# EAGLE design untitled (EAGLE 5.11)

## Sheet 1 of 3
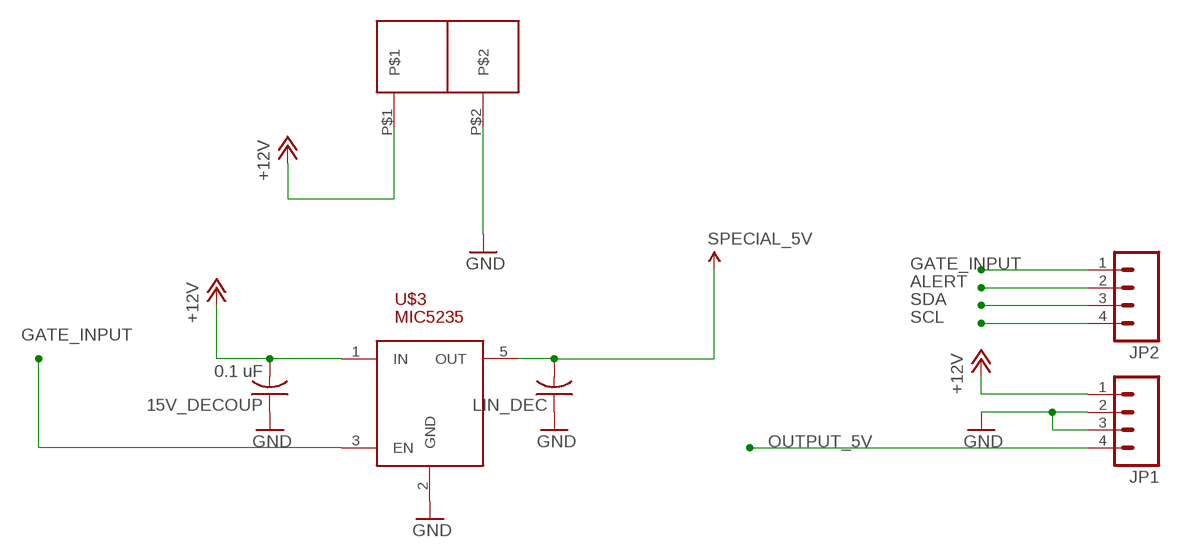
[diagram p0: schematic, sheet 1]

### Parts
15V_DECOUP  0.1 uF  C-USC0603K  [C0603K]
JP1  M04PTH  [1X04]
JP2  M04PTH  [1X04]
LIN_DEC  C-USC0603K  [C0603K]
U$1  PLUG_TERM_2  [TERM_BLOCK_2]
U$3  MIC5235  [SOT23-5]

### Nets
+12V: 15V_DECOUP.2 JP1.1 U$1.P$1 U$3.1(IN) ; also sheet 2
ALERT: JP2.2 ; also sheet 3
GATE_INPUT: JP2.1 U$3.3(EN) ; also sheet 2
GND: 15V_DECOUP.1 JP1.2 JP1.3 LIN_DEC.1 U$1.P$2 U$3.2(GND) ; also sheet 2,3
OUTPUT_5V: JP1.4 ; also sheet 3
SCL: JP2.4 ; also sheet 3
SDA: JP2.3 ; also sheet 3
VCC: LIN_DEC.2 U$3.5(OUT) ; supply symbol labelled SPECIAL_5V ; also sheet 3

## Sheet 2 of 3
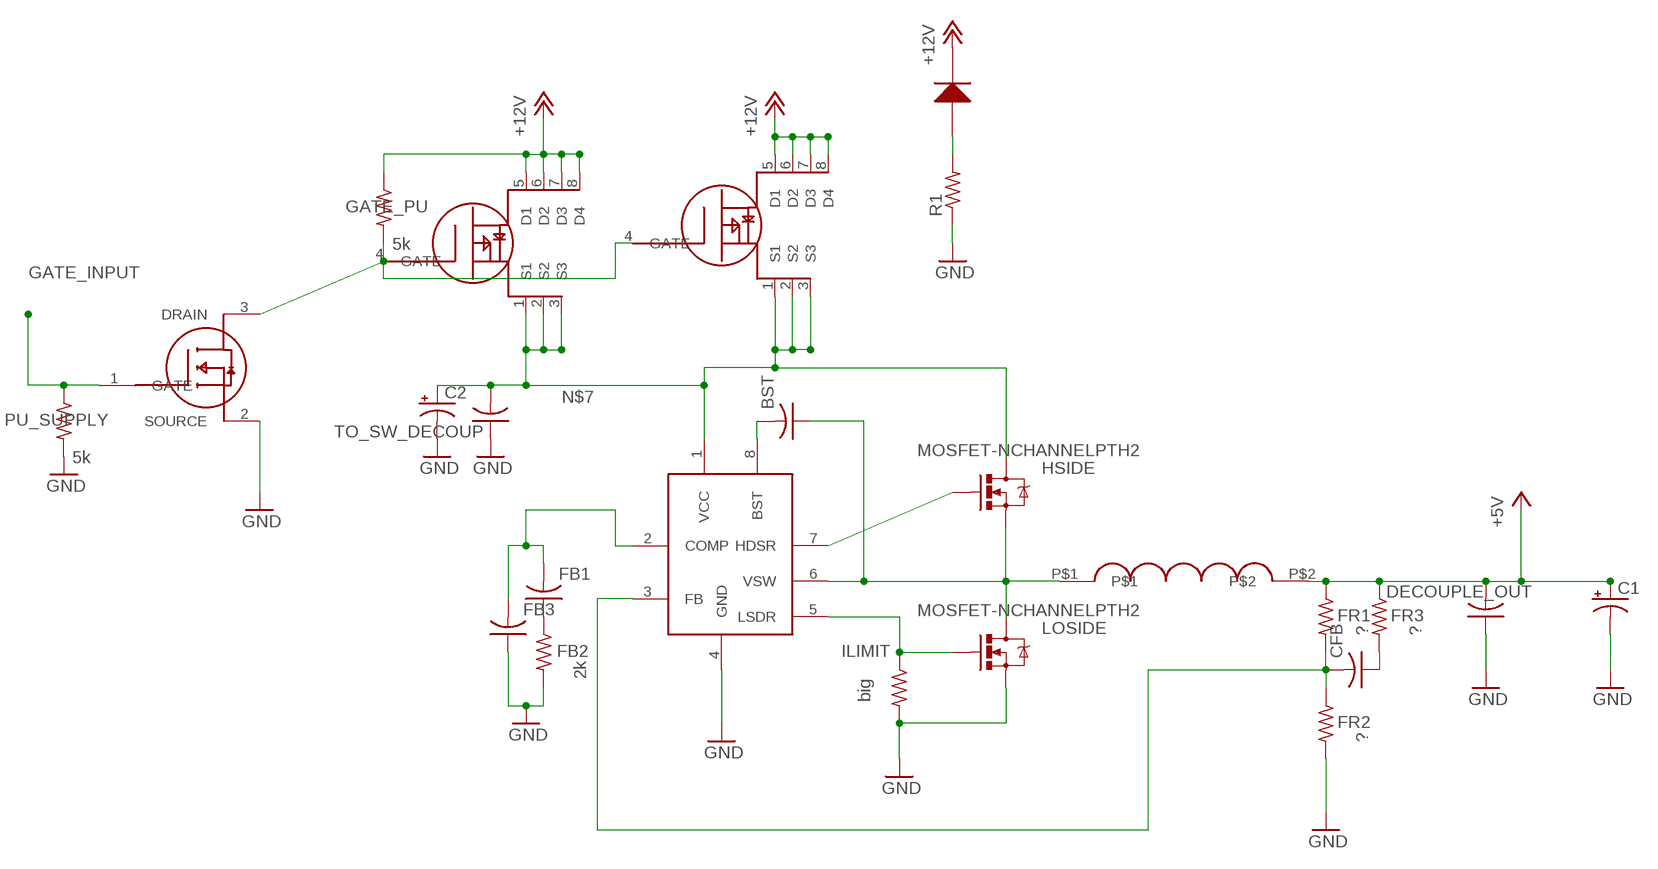
[diagram p1: schematic, sheet 2]

### Parts
BST  C-USC0603K  [C0603K]
C1  CAP_POLPTH2  [CPOL-RADIAL-10UF-25V]
C2  CAP_POLPTH2  [CPOL-RADIAL-10UF-25V]
CFB  C-USC0603K  [C0603K]
DECOUPLE_OUT  C-USC0603K  [C0603K]
FB1  C-USC0603K  [C0603K]
FB2  2k  R-US_R0805  [R0805]
FB3  C-USC0603K  [C0603K]
FR1  ?  R-US_R0805  [R0805]
FR2  ?  R-US_R0805  [R0805]
FR3  ?  R-US_R0805  [R0805]
GATE_PU  5k  R-US_R0805  [R0805]
HSIDE  MOSFET-NCHANNELPTH2  [TO220V]
ILIMIT  big  R-US_R0805  [R0805]
LOSIDE  MOSFET-NCHANNELPTH2  [TO220V]
PU_SUPPLY  5k  R-US_R0805  [R0805]
R1  R-US_R0805  [R0805]
SW_IN  LED  [D0805]
TO_SW_DECOUP  C-USC0603K  [C0603K]
U$2  NR10050  [NR10050]
U$4  IRFML8244  [SOT23]
U$7  IRF9317  [SOIC8]
U$8  NCP3030  [SOIC8]
U$9  IRF9317  [SOIC8]

### Nets
+5V: C1.1(+) DECOUPLE_OUT.2 FR1.1 FR3.1 U$2.P$2 ; also sheet 3
+12V: GATE_PU.1 SW_IN.2 U$7.5(D1) U$7.6(D2) U$7.7(D3) U$7.8(D4) U$9.5(D1) U$9.6(D2) U$9.7(D3) U$9.8(D4) ; also sheet 1
GATE_INPUT: PU_SUPPLY.1 U$4.1(GATE) ; also sheet 1
GND: C1.2(-) C2.2(-) DECOUPLE_OUT.1 FB2.2 FB3.1 FR2.2 ILIMIT.2 LOSIDE.3(S) PU_SUPPLY.2 R1.1 TO_SW_DECOUP.1 U$4.2(SOURCE) U$8.4(GND) ; also sheet 1,3
N$1: CFB.2 FR1.2 FR2.1 U$8.3(FB)
N$2: BST.2 U$8.8(BST)
N$3: CFB.1 FR3.2
N$5: BST.1 HSIDE.3(S) LOSIDE.2(D) U$2.P$1 U$8.6(VSW)
N$7: C2.1(+) HSIDE.2(D) TO_SW_DECOUP.2 U$7.1(S1) U$7.2(S2) U$7.3(S3) U$8.1(VCC) U$9.1(S1) U$9.2(S2) U$9.3(S3)
N$8: HSIDE.1(G) U$8.7(HDSR)
N$9: ILIMIT.1 LOSIDE.1(G) U$8.5(LSDR)
N$17: FB1.1 FB2.1
N$18: FB1.2 FB3.2 U$8.2(COMP)
N$19: R1.2 SW_IN.1
N$27: GATE_PU.2 U$4.3(DRAIN) U$7.4(GATE) U$9.4(GATE)

## Sheet 3 of 3
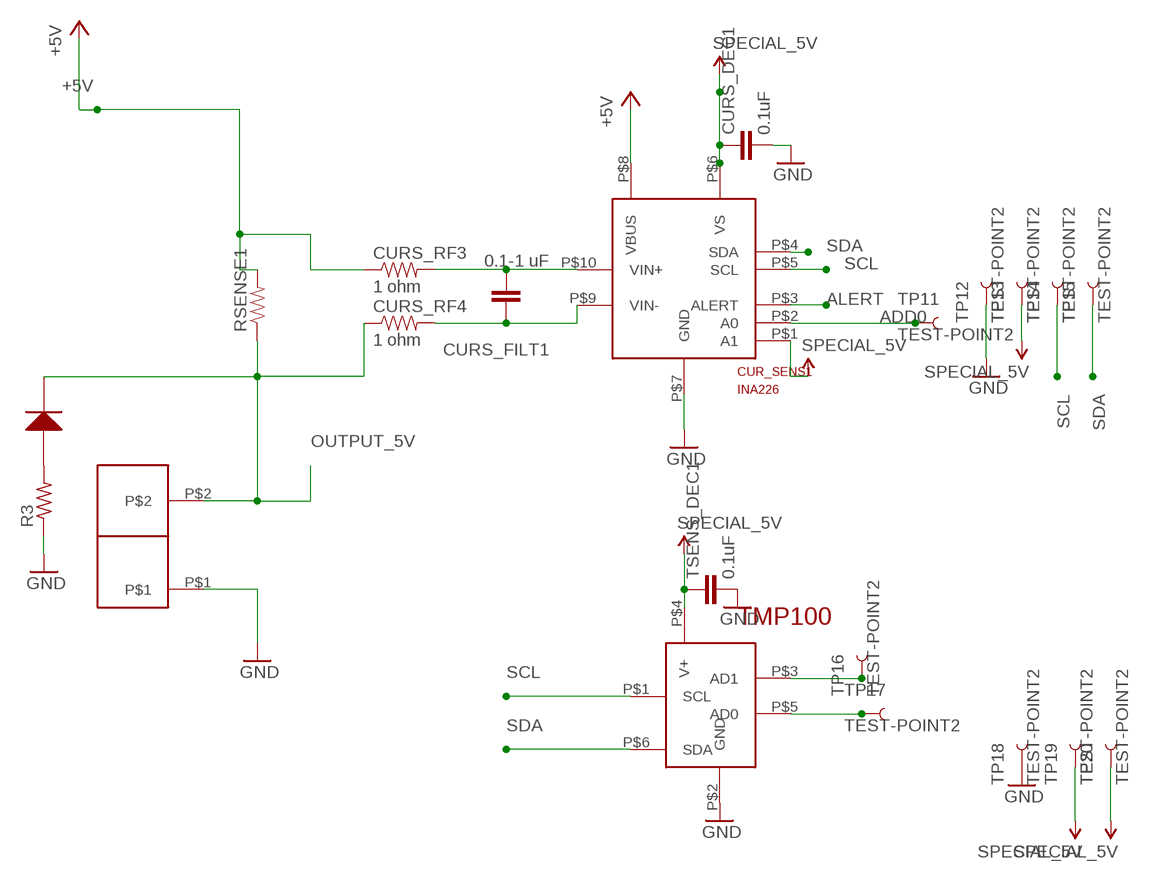
[diagram p2: schematic, sheet 3]

### Parts
CUR_SENS1  INA226  [PSOP-10]
CURS_DEC1  0.1uF  CAP0603-CAP  [0603-CAP]
CURS_FILT1  0.1-1 uF  CAP0603-CAP  [0603-CAP]
CURS_RF3  1 ohm  RESISTOR0603-RES  [0603-RES]
CURS_RF4  1 ohm  RESISTOR0603-RES  [0603-RES]
R3  R-US_R0805  [R0805]
RSENSE1  RESISTOR1206  [1206]
SW_OUT1  LED  [D0805]
TP11  TEST-POINT2  [PAD.02X.02]
TP12  TEST-POINT2  [PAD.02X.02]
TP13  TEST-POINT2  [PAD.02X.02]
TP14  TEST-POINT2  [PAD.02X.02]
TP15  TEST-POINT2  [PAD.02X.02]
TP16  TEST-POINT2  [PAD.02X.02]
TP17  TEST-POINT2  [PAD.02X.02]
TP18  TEST-POINT2  [PAD.02X.02]
TP19  TEST-POINT2  [PAD.02X.02]
TP20  TEST-POINT2  [PAD.02X.02]
TSENS_DEC1  0.1uF  CAP0603-CAP  [0603-CAP]
U$10  PLUG_TERM_2  [TERM_BLOCK_2]
U$11  TMP100  [PSOP-6]

### Nets
+5V: CUR_SENS1.P$8(VBUS) CURS_RF3.1 RSENSE1.2 ; also sheet 2
ADD0: CUR_SENS1.P$2(A0) TP11.P$1
ALERT: CUR_SENS1.P$3(ALERT) ; also sheet 1
GND: CUR_SENS1.P$7(GND) CURS_DEC1.2 R3.1 TP12.P$1 TP18.P$1 TSENS_DEC1.2 U$10.P$1 U$11.P$2(GND) ; also sheet 1,2
N$6: R3.2 SW_OUT1.1
N$10: CUR_SENS1.P$10(VIN+) CURS_FILT1.2 CURS_RF3.2
N$11: CUR_SENS1.P$9(VIN-) CURS_FILT1.1 CURS_RF4.2
OUTPUT_5V: CURS_RF4.1 RSENSE1.1 SW_OUT1.2 U$10.P$2 ; also sheet 1
SCL: CUR_SENS1.P$5(SCL) TP14.P$1 U$11.P$1(SCL) ; also sheet 1
SDA: CUR_SENS1.P$4(SDA) TP15.P$1 U$11.P$6(SDA) ; also sheet 1
T_AD2: TP16.P$1 U$11.P$3(AD1)
T_AD3: TP17.P$1 U$11.P$5(AD0)
VCC: CUR_SENS1.P$1(A1) CUR_SENS1.P$6(VS) CURS_DEC1.1 TP13.P$1 TP19.P$1 TP20.P$1 TSENS_DEC1.1 U$11.P$4(V+) ; supply symbol labelled SPECIAL_5V ; also sheet 1

## Library data of the parts
15V_DECOUP BST CFB DECOUPLE_OUT FB1 FB3 LIN_DEC TO_SW_DECOUP = resistor:C-US: CAPACITOR, American symbol
C1 C2 = SparkFun:CAP_POL: Capacitor Polarized These are standard SMD and PTH capacitors. Normally 10uF, 47uF, and 100uF in electrolytic and tantalum varieties. Always verify the external diameter of the through hole cap, it varies with capacity, voltage, and manufacturer. The EIA devices should be standard.
CUR_SENS1 = chlk_bot:INA226
CURS_DEC1 CURS_FILT1 TSENS_DEC1 = SparkFun:CAP: Capacitor Standard 0603 ceramic capacitor, and 0.1" leaded capacitor.
CURS_RF3 CURS_RF4 RSENSE1 = SparkFun:RESISTOR: Resistor Basic schematic elements and footprints for 0603, 1206, and PTH resistors.
FB2 FR1-FR3 GATE_PU ILIMIT PU_SUPPLY = resistor:R-US_: RESISTOR, American symbol
HSIDE LOSIDE = SparkFun:MOSFET-NCHANNEL
JP1 JP2 = SparkFun:M04: Header 4 Standard 4-pin 0.1" header. Use with straight break away headers (SKU : PRT-00116), right angle break away headers (PRT-00553), swiss pins (PRT-00743), machine pins (PRT-00117), and female headers (PRT-00115). Molex polarized connector foot print use with SKU : PRT-08231 with associated crimp pins and housings. 1MM SMD Version SKU: PRT-10208
R1 R3 = rcl:R-US_: RESISTOR, American symbol
SW_IN SW_OUT1 = ipad_thingy:LED
TP11-TP20 = SparkFun:TEST-POINT
U$1 U$10 = chlk_bot:PLUG_TERM_2
U$2 = chlk_bot:NR10050
U$3 = chlk_bot:MIC5235
U$4 = chlk_bot:IRFML8244
U$7 U$9 = chlk_bot:IRF9317
U$8 = chlk_bot:NCP3030
U$11 = chlk_bot:TMP100

## Board
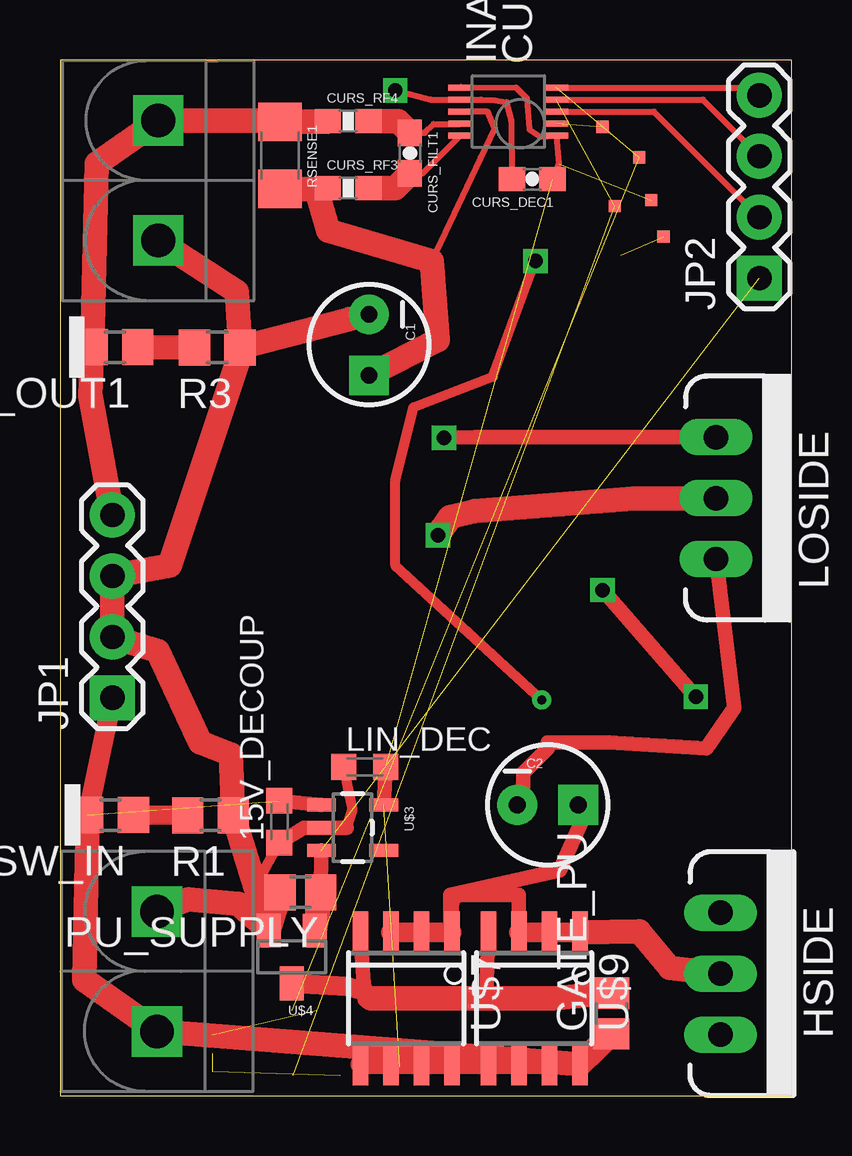
[diagram p3: board, top side]
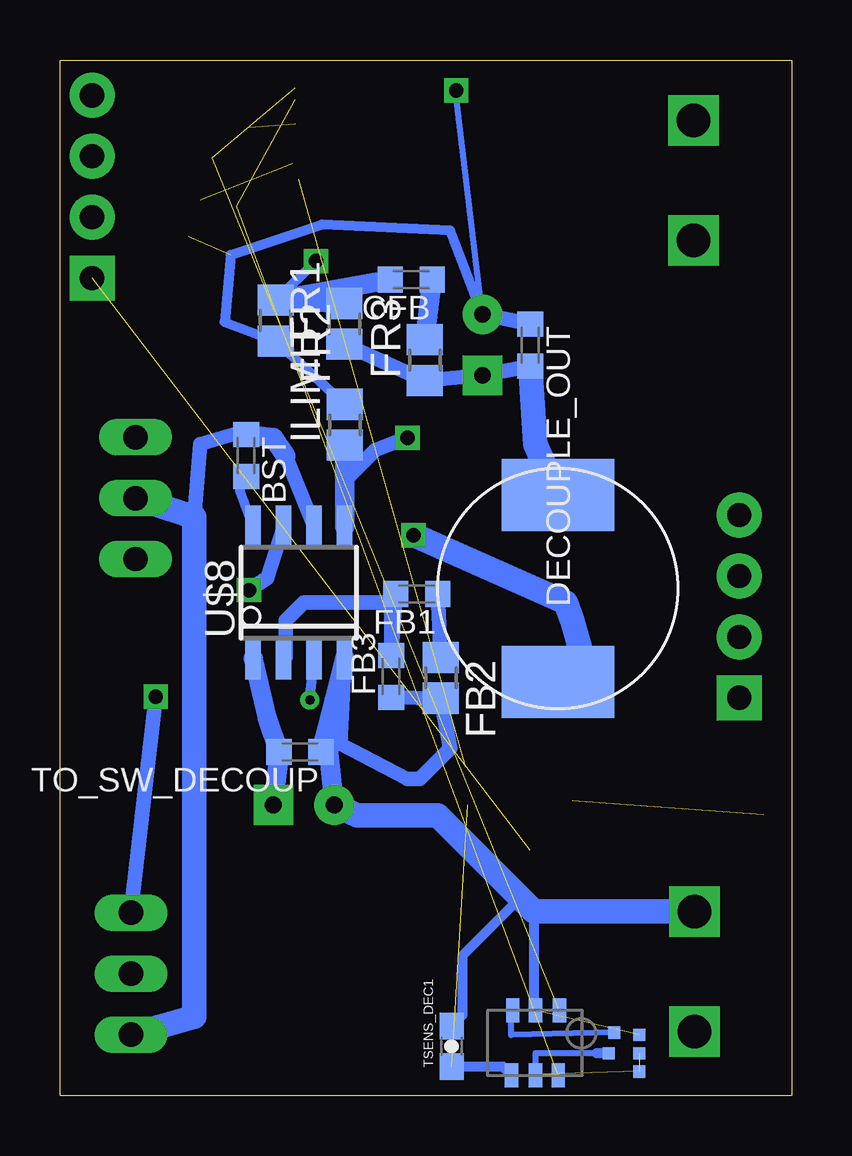
[diagram p4: board, bottom side, seen from below]

Size 30.48 x 43.18 mm. Coordinates in mm from the lower left corner, seen from the top.
Outline: 0,0 30.48,0 30.48,43.18 0,43.18 0,0
Copper layers (1*16): Top 0.035mm / dielectric 1.5mm / Bottom 0.035mm
Design rules "default": minimum track width 10mil, minimum drill 24mil, track to track 8mil, track to pad 8mil, pad to pad 8mil, via to via 8mil, smd to smd 8mil, copper to edge 40mil, drill to drill 8mil, minimum pad ring 10mil, minimum via ring 8mil, stop-mask expansion 4mil, vias tented up to drill 0mil, thermal gap 10mil

### Footprints (pad centres in the part's own frame; a part is rotated, then mirrored left to right if it is on the bottom)
C0603K = smd 1.05 x 1.08: 1 -0.875,0; 2 0.875,0
CPOL-RADIAL-10UF-25V = drill 0.7 pad 1.651 square: 1 1.27,0 | drill 0.7 pad 1.651 round: 2 -1.27,0
PSOP-10 = smd 0.25 x 1: P$1 -0.5,-1.5; P$2 0,-1.5; P$3 0.5,-1.5; P$4 1,-1.5; P$5 1.5,-1.5; P$6 1.5,2.5; P$7 1,2.5; P$8 0.5,2.5; P$9 0,2.5; P$10 -0.5,2.5
0603-CAP = smd 1.1 x 1: 1 -0.85,0; 2 0.85,0
0603-RES = smd 1.1 x 1: 1 -0.85,0; 2 0.85,0
R0805 = smd 1.3 x 1.5: 1 -0.85,0; 2 0.85,0
TO220V = drill 1.016 long: 1 -2.54,0; 2 0,0; 3 2.54,0
1X04 = drill 1.016 pad 1.88 square: 1 0,0 | drill 1.016 pad 1.88 round: 2 2.54,0; 3 5.08,0; 4 7.62,0
R0805' = smd 1.3 x 1.5: 1 -0.95,0; 2 0.95,0
1206 = smd 1.6 x 1.8: 1 -1.4,0; 2 1.4,0
D0805 = smd 1.3 x 1.5: 1 -0.95,0; 2 0.95,0
PAD.02X.02 = smd 0.508 x 0.508: P$1 0,0
TERM_BLOCK_2 = drill 1.4 square: P$1 -2.5,0; P$2 2.5,0
NR10050 = smd 3 x 4.7: P$1 -3.9,0; P$2 3.9,0
SOT23-5 = smd 0.55 x 1.2: 1 -0.95,-1.3; 2 0,-1.3; 3 0.95,-1.3; 4 0.95,1.3; 5 -0.95,1.3
SOT23 = smd 1 x 1.4: 1 -0.95,-1.1; 2 0.95,-1.1; 3 0,1.1
SOIC8 = smd 0.65 x 1.75: 1 -1.905,-2.75; 2 -0.635,-2.75; 3 0.635,-2.75; 4 1.905,-2.75; 5 1.905,2.75; 6 0.635,2.75; 7 -0.635,2.75; 8 -1.905,2.75
PSOP-6 = smd 0.55 x 1: P$1 -1,0; P$2 0,0; P$3 0.95,0; P$4 1,2.7; P$5 0,2.7; P$6 -0.95,2.7

### Placement (x,y rotation side)
15V_DECOUP  9.14,11.43 90 top
BST  22.73,26.69 270 bottom
C1  12.88,31.31 270 top
C2  20.32,12.13 0 top
CFB  15.84,34.02 180 bottom
CUR_SENS1  19.18,40.52 90 top
CURS_DEC1  19.68,38.21 180 top
CURS_FILT1  14.57,39.3 270 top
CURS_RF3  12.01,37.83 0 top
CURS_RF4  12.01,40.63 0 top
DECOUPLE_OUT  10.88,31.3 270 bottom
FB1  15.62,20.92 180 bottom
FB2  14.61,17.42 270 bottom
FB3  16.69,17.49 90 bottom
FR1  18.63,32.18 90 bottom
FR2  21.5,32.31 270 bottom
FR3  15.27,30.67 90 bottom
GATE_PU  22.97,3.44 90 top
HSIDE  27.52,5.09 270 top
ILIMIT  18.61,27.97 90 bottom
JP1  2.18,16.59 90 top
JP2  29.14,34.09 90 top
LIN_DEC  12.7,13.72 0 top
LOSIDE  27.34,24.92 270 top
PU_SUPPLY  10.02,8.48 180 top
R1  [R0805']  6.27,11.7 180 top
R3  [R0805']  6.55,31.2 180 top
RSENSE1  9.16,39.2 270 top
SW_IN  2.11,11.71 180 top
SW_OUT1  2.29,31.21 180 top
TO_SW_DECOUP  20.48,14.34 180 bottom
TP11  22.61,40.39 90 top
TP12  25.15,35.81 90 top
TP13  24.64,37.34 90 top
TP14  24.13,39.12 90 top
TP15  23.11,37.08 90 top
TP16  7.39,2.64 90 bottom
TP17  7.62,1.78 90 bottom
TP18  6.35,2.54 90 bottom
TP19  6.35,1.78 90 bottom
TP20  6.35,1.02 90 bottom
TSENS_DEC1  14.16,2.06 90 bottom
U$1  4.05,5.18 90 top
U$2  9.73,21.15 90 bottom
U$3  12.19,11.18 270 top
U$4  9.66,5.79 180 top
U$7  14.42,4.06 180 top
U$8  20.53,20.97 0 bottom
U$9  19.76,4.06 180 top
U$10  4.09,38.16 90 top
U$11  10.67,3.56 180 bottom

### Tracks (layer width: path | path; a pad name or v marks a point on that pad's centre or on a via)
+5V
  Top 0.254: CUR_SENS1.P$8 17.83,41.02 18.11,40.34 17.53,39.12 15.49,34.8
  Top 1.016: 10.67,37.8 RSENSE1.2 | 10.67,37.8 11.13,37.8 CURS_RF3.1 | C1.1 15.75,31.5 15.49,34.8 11.18,36.07 10.67,37.8
  Bottom 0.61: DECOUPLE_OUT.2 C1.1 FR3.1 FR1.1
  Bottom 1.016: U$2.P$2 10.67,27.18 DECOUPLE_OUT.2
+12V  (1 unrouted)
  Top 0.61: 15V_DECOUP.2 U$3.1
  Top 0.813: U$9.8 U$9.7 U$9.6 U$9.5 U$7.8 U$7.7 U$7.6 U$7.5 | SW_IN.2 JP1.1
  Top 1.016: SW_IN.2 1.02,4.83 U$1.P$1 U$9.8 GATE_PU.1
ADD0  (1 unrouted)
ALERT
  Top 0.254: CUR_SENS1.P$3 24.74,41.02 JP2.2
GATE_INPUT  (1 unrouted)
  Top 0.61: PU_SUPPLY.1 U$3.3
  Top 1.016: U$4.1 PU_SUPPLY.1
GND  (via drill 0.6)  (2 unrouted)
  Top 0.254: CURS_DEC1.2 18.8,40.64 18.6,41.42 18.11,41.5 17.55,41.53 CUR_SENS1.P$7 15.44,41.53 v13.97,41.91
  Top 0.406: 11.94,11.18 12.19,11.94 LIN_DEC.1 | 8.14,8.74 15V_DECOUP.1
  Top 0.61: LOSIDE.3 28.1,16.16 26.92,14.48 22.86,14.73 20.32,14.73 20.32,14.48 19.3,13.46 19.3,12.89 C2.2 | C1.2 12,32.58 11.68,32.26 7.62,31.24 | 15V_DECOUP.1 10.16,11.18 U$3.2 11.94,11.18
  Top 1.016: U$10.P$1 7.37,33.53 R3.1 C1.2 | U$4.2 8.14,8.74 R1.1 7.11,14.22 5.84,14.73 4.06,18.54 JP1.2 JP1.3 4.57,22.1 7.62,31.24 | U$4.2 PU_SUPPLY.2 | U$4.2 7.44,8.01 5.33,8.19 U$1.P$2
  Bottom 0.254: C1.2 13.97,41.66 v13.97,41.91
  Bottom 0.406: ILIMIT.2 FR2.2 23.62,32.26 23.37,35.05 19.56,36.32 14.22,36.07 C1.2 | TSENS_DEC1.2 13.72,3.36 13.72,5.84 11.43,8.13 11.43,8.38 | U$11.P$2 10.73,3.62 10.73,7.68
  Bottom 0.61: C1.2 DECOUPLE_OUT.1 | FB3.1 FB2.2 14.22,14.48 15.49,13.21 16,13.21 18.8,14.67 U$8.4
  Bottom 0.813: C2.2 19.3,14.48 TO_SW_DECOUP.1 19.05,16.51 U$8.4
  Bottom 1.016: U$1.P$2 10.73,7.68 11.43,8.38 14.73,11.68 18.1,11.68 C2.2
N$1  (via drill 0.38, 0.6)
  Top 0.406: v19.81,34.8 18.03,29.97 14.73,28.7 13.97,25.65 13.97,22.1 v20.07,16.51
  Bottom 0.406: v19.81,34.8 FR2.1 | v20.07,16.51 U$8.3
  Bottom 0.813: CFB.2 FR2.1 FR1.2
N$2
  Bottom 0.406: U$8.8 22.98,25.25 BST.2
N$3
  Bottom 0.813: CFB.1 FR3.2
N$5  (via drill 0.6)
  Top 1.016: v15.75,23.37 16.26,24.13 17.27,24.38 23.88,24.89 27.31,24.89 LOSIDE.2
  Bottom 0.61: 21.08,26.67 U$8.6 | BST.1 22.86,27.69 24.64,27.18 24.89,24.13
  Bottom 0.813: BST.1 21.59,27.43 21.08,26.67
  Bottom 1.016: HSIDE.3 24.89,3.3 24.89,24.13 LOSIDE.2 | U$2.P$1 8.41,17.25 9.14,19.81 9.4,20.57 v15.75,23.37
N$6
  Top 1.016: SW_OUT1.1 R3.2
N$7
  Top 0.61: U$9.3 19.12,8.38 16.76,8.38 arc90 16.33,7.95 U$7.1 | U$7.3 arc-90 13.83,6.86 16.26,6.86 16.26,8.38 20.83,9.4 21.84,11.68 21.84,12.13 C2.1
  Top 0.813: U$9.1 U$9.2 U$9.3 | U$7.1 U$7.2 U$7.3
  Top 1.016: U$9.1 24.13,6.86 25.4,5.33 HSIDE.2
  Bottom 0.813: C2.1 21.34,14.22 TO_SW_DECOUP.2 21.84,15.75 U$8.1
N$8  (via drill 0.6)
  Top 0.61: v26.49,16.64 v22.61,21.08
  Bottom 0.61: U$8.7 21.84,21.59 v22.61,21.08 | HSIDE.1 v26.49,16.64
N$9  (via drill 0.6)
  Top 0.61: LOSIDE.1 17.3,27.46 v16,27.43
  Bottom 0.61: v16,27.43 17.35,26.92 18.62,25.66
  Bottom 0.813: U$8.5 18.62,25.66 ILIMIT.1
N$10
  Top 0.254: CURS_FILT1.2 15.1,38.45 CUR_SENS1.P$10
  Top 1.016: CURS_RF3.2 13.96,37.83 CURS_FILT1.2
N$11
  Top 0.254: CURS_FILT1.1 15.2,40.15 15.57,40.51 CUR_SENS1.P$9
  Top 1.016: CURS_RF4.2 14.09,40.63 CURS_FILT1.1
N$17
  Bottom 0.61: FB2.1 FB1.1
N$18
  Bottom 0.61: FB1.2 FB3.2 16.69,20.5 16.76,20.57 20.32,20.57 21.08,19.81 21.08,18.3 U$8.2
N$19
  Top 0.813: SW_IN.1 R1.2
N$27
  Top 0.61: U$9.4 17.78,4.75 17.78,4.06 | U$7.4 12.68,4.35 12.7,3.99 12.95,4.06
  Top 0.813: U$4.3 11.94,4.57 12.68,4.35
  Top 1.016: GATE_PU.2 20.57,4.06 17.78,4.06 12.95,4.06
OUTPUT_5V
  Top 1.016: JP1.4 1.27,29.21 SW_OUT1.2 1.52,38.86 U$10.P$2 9.11,40.66 RSENSE1.1 11.13,40.6 CURS_RF4.1
SCL  (2 unrouted)
  Top 0.254: CUR_SENS1.P$5 28.82,42.02 JP2.4
SDA  (2 unrouted)
  Top 0.254: CUR_SENS1.P$4 26.78,41.52 JP2.3
T_AD2
  Bottom 0.254: U$11.P$3 11.68,3.49 11.68,2.54 TP16.P$1
T_AD3
  Bottom 0.254: 8.13,1.78 10.67,1.78 U$11.P$5
  Bottom 0.406: TP17.P$1 8.13,1.78
VCC  (5 unrouted)
  Top 0.254: CURS_DEC1.1 20.78,38.85 CUR_SENS1.P$1 20.02,39.98 19.56,40.28 19.46,41.58 19,42.04 CUR_SENS1.P$6 16.72,42.06
  Top 0.61: U$3.5 LIN_DEC.2
  Bottom 0.406: U$11.P$4 12.03,1.21 TSENS_DEC1.1